# Altium schematic sheet Main.SchDoc: Smartknob Main
size A3; DrawnBy: Mani Magnusson; Revision: 1; SheetNumber: 1; SheetTotal: 5
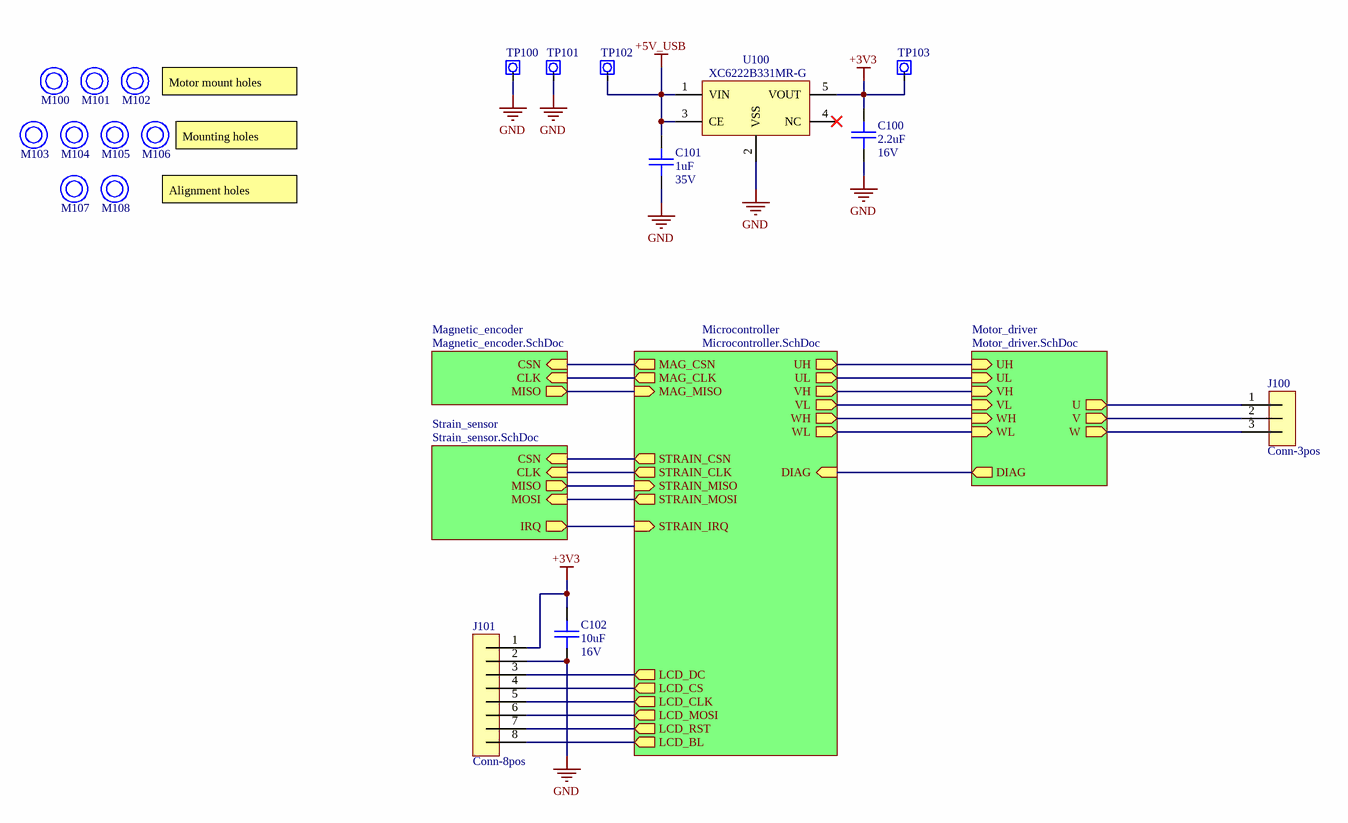
[diagram p0: Main.SchDoc]

## Parts
C100  value 2.2uF  Voltage: 16V  [C0805]  (hidden comment: CAP)
C101  value 1uF  Voltage: 35V  [C0603]  (hidden comment: CAP)
C102  value 10uF  Voltage: 16V  [C0805]  (hidden comment: CAP)
J100  Conn-3pos  [0532610371]
J101  Conn-8pos  [2mm_pads_8]
M100  Mounting_Hole_Unplated  [M1.6_Close_Unplated]  (value not drawn)
M101  Mounting_Hole_Unplated  [M1.6_Close_Unplated]  (value not drawn)
M102  Mounting_Hole_Unplated  [M1.6_Close_Unplated]  (value not drawn)
M103  Mounting_Hole_Unplated  [M2_Normal_Unplated]  (value not drawn)
M104  Mounting_Hole_Unplated  [M2_Normal_Unplated]  (value not drawn)
M105  Mounting_Hole_Unplated  [M2_Normal_Unplated]  (value not drawn)
M106  Mounting_Hole_Unplated  [M2_Normal_Unplated]  (value not drawn)
M107  Mounting_Hole_Unplated  [M2_Close_Unplated]  (value not drawn)
M108  Mounting_Hole_Unplated  [M2_Close_Unplated]  (value not drawn)
TP100  Testpoint  [5019]  (value not drawn)
TP101  Testpoint  [5019]  (value not drawn)
TP102  Testpoint  [5019]  (value not drawn)
TP103  Testpoint  [5019]  (value not drawn)
U100  XC6222B331MR-G  [SOT-25-5]

## Sub-sheets
Magnetic_encoder = Magnetic_encoder.SchDoc: CSN (in), CLK (in), MISO (out)
Microcontroller = Microcontroller.SchDoc: UH (out), UL (out), VH (out), VL (out), WH (out), WL (out), DIAG (in), MAG_MISO (in), STRAIN_MOSI (out), MAG_CLK (out), MAG_CSN (out), STRAIN_CSN (out), STRAIN_IRQ (in), STRAIN_MISO (in), STRAIN_CLK (out), LCD_CS (out), LCD_BL (out), LCD_DC (out), LCD_RST (out), LCD_CLK (out), LCD_MOSI (out)
Motor_driver = Motor_driver.SchDoc: UH (in), UL (in), VH (in), VL (in), WH (in), WL (in), DIAG (out), U (out), V (out), W (out)
Strain_sensor = Strain_sensor.SchDoc: CSN (in), CLK (in), MOSI (in), MISO (out), IRQ (out)

## Nets
+3V3: C100.1 C102.1 J101.1 TP103.1 U100.5(VOUT)
+5V_USB: C101.1 TP102.1 U100.1(VIN) U100.3(CE)
GND: C100.2 C101.2 C102.2 J101.2 TP100.1 TP101.1 U100.2(VSS)
NetJ100_1: J100.1 ; sheet Motor_driver/U
NetJ100_2: J100.2 ; sheet Motor_driver/V
NetJ100_3: J100.3 ; sheet Motor_driver/W
NetJ101_3: J101.3 ; sheet Microcontroller/LCD_DC
NetJ101_4: J101.4 ; sheet Microcontroller/LCD_CS
NetJ101_5: J101.5 ; sheet Microcontroller/LCD_CLK
NetJ101_6: J101.6 ; sheet Microcontroller/LCD_MOSI
NetJ101_7: J101.7 ; sheet Microcontroller/LCD_RST
NetJ101_8: J101.8 ; sheet Microcontroller/LCD_BL
(unnamed): sheet Microcontroller/UH, sheet Motor_driver/UH
(unnamed): sheet Microcontroller/UL, sheet Motor_driver/UL
(unnamed): sheet Microcontroller/VH, sheet Motor_driver/VH
(unnamed): sheet Microcontroller/VL, sheet Motor_driver/VL
(unnamed): sheet Microcontroller/WH, sheet Motor_driver/WH
(unnamed): sheet Microcontroller/WL, sheet Motor_driver/WL
(unnamed): sheet Microcontroller/DIAG, sheet Motor_driver/DIAG
(unnamed): sheet Microcontroller/MAG_MISO, sheet Magnetic_encoder/MISO
(unnamed): sheet Microcontroller/STRAIN_MOSI, sheet Strain_sensor/MOSI
(unnamed): sheet Microcontroller/MAG_CLK, sheet Magnetic_encoder/CLK
(unnamed): sheet Microcontroller/MAG_CSN, sheet Magnetic_encoder/CSN
(unnamed): sheet Microcontroller/STRAIN_CSN, sheet Strain_sensor/CSN
(unnamed): sheet Microcontroller/STRAIN_IRQ, sheet Strain_sensor/IRQ
(unnamed): sheet Microcontroller/STRAIN_MISO, sheet Strain_sensor/MISO
(unnamed): sheet Microcontroller/STRAIN_CLK, sheet Strain_sensor/CLK

Not connected (* = marked no-connect by the designer): U100 4(NC)*

## Notes on the sheet
- Motor mount holes
- (near M106) Mounting holes
- Alignment holes
- Sheet title:
- Revision:
- Drawn by:
- Date:
- File:

## Library data of the parts
C100 = CGA4J3X7R1C225K125AB: General purpose ceramic capacitor; Manufacturer: TDK Corporation; Specification: X7R, 16V, AEC-Q200 Qualified; Ready for use: y; Fitted: Fitted; Package Ref: C0805; Part Reference: CGA4J3X7R1C225K125AB; Manufacturer Part No: CGA4J3X7R1C225K125AB; Supplier: Digi-Key; Supplier Part No: 445-5691-1-ND; Generic: Generic
C101 = CGA3E1X7R1V105K080AC: General purpose ceramic capacitor; Manufacturer: TDK Corporation; Specification: X7R, 35V, AEC-Q200 Qualified; Ready for use: y; Fitted: Fitted; Package Ref: C0603; Part Reference: CGA3E1X7R1V105K080AC; Manufacturer Part No: CGA3E1X7R1V105K080AC; Supplier: Digi-Key; Supplier Part No: 445-174215-1-ND; Generic: Generic
C102 = CGA4J1X7S1C106K125AC: General purpose ceramic capacitor; Manufacturer: TDK Corporation; Specification: X7S, 16V, AEC-Q200 Qualified; Ready for use: y; Fitted: Fitted; Package Ref: C0805; Part Reference: CGA4J1X7S1C106K125AC; Manufacturer Part No: CGA4J1X7S1C106K125AC; Supplier: Digi-Key; Supplier Part No: 445-16110-1-ND; Generic: Generic
J100 = 0532610371: 3 pin horizontal picoblade connector; Manufacturer: Molex; Generic: Non Generic; Specification: 125 V 1 A max; Ready for use: y; Fitted: Fitted; Package Ref: 0532610371; Part Reference: 0532610371; Manufacturer Part No: 0532610371; Supplier: Digi-Key; Supplier Part No: WM7621CT-ND
J101 = 2mm_pads_8: 2mm pitch solder pads; Ready for use: n; Fitted: Fitted; Package Ref: 2mm_pads_8; Part Reference: 2mm_pads_8; Manufacturer Part No: 2mm_pads_8; Generic: Generic
M100-M102 = M1.6_Close_Unplated: M1.6 Hole, Unplated; Specification: Close clearance; Ready for use: y; Fitted: Fitted; Package Ref: M1.6_Close_Unplated; Part Reference: M1.6_Close_Unplated; Generic: Generic
M103-M106 = M2_Normal_Unplated: M2 Hole, Unplated; Specification: Normal clearance; Ready for use: y; Fitted: Fitted; Package Ref: M2_Normal_Unplated; Part Reference: M2_Normal_Unplated; Generic: Generic
M107 M108 = M2_Close_Unplated: M2 Hole, Unplated; Specification: Close clearance; Ready for use: y; Fitted: Fitted; Package Ref: M2_Close_Unplated; Part Reference: M2_Close_Unplated; Generic: Generic
TP100-TP103 = 5019: SMD Testpoint, loop style; Manufacturer: Keystone Electronics; Ready for use: y; Fitted: Fitted; Package Ref: 5019; Part Reference: 5019; Manufacturer Part No: 5019; Supplier: Digi-Key; Supplier Part No: 36-5019CT-ND; Generic: Generic
U100 = XC6222B331MR-G: 3.3V 700mA LDO linear regulator; Manufacturer: Torex Semiconductor; Generic: Non Generic; Ready for use: y; Fitted: Fitted; Package Ref: SOT-25-5; Part Reference: XC6222B331MR-G; Manufacturer Part No: XC6222B331MR-G; Supplier: Digi-Key; Supplier Part No: 893-1143-1-ND; Type: PMIC